# EAGLE schematic dimmer (EAGLE 6.4)
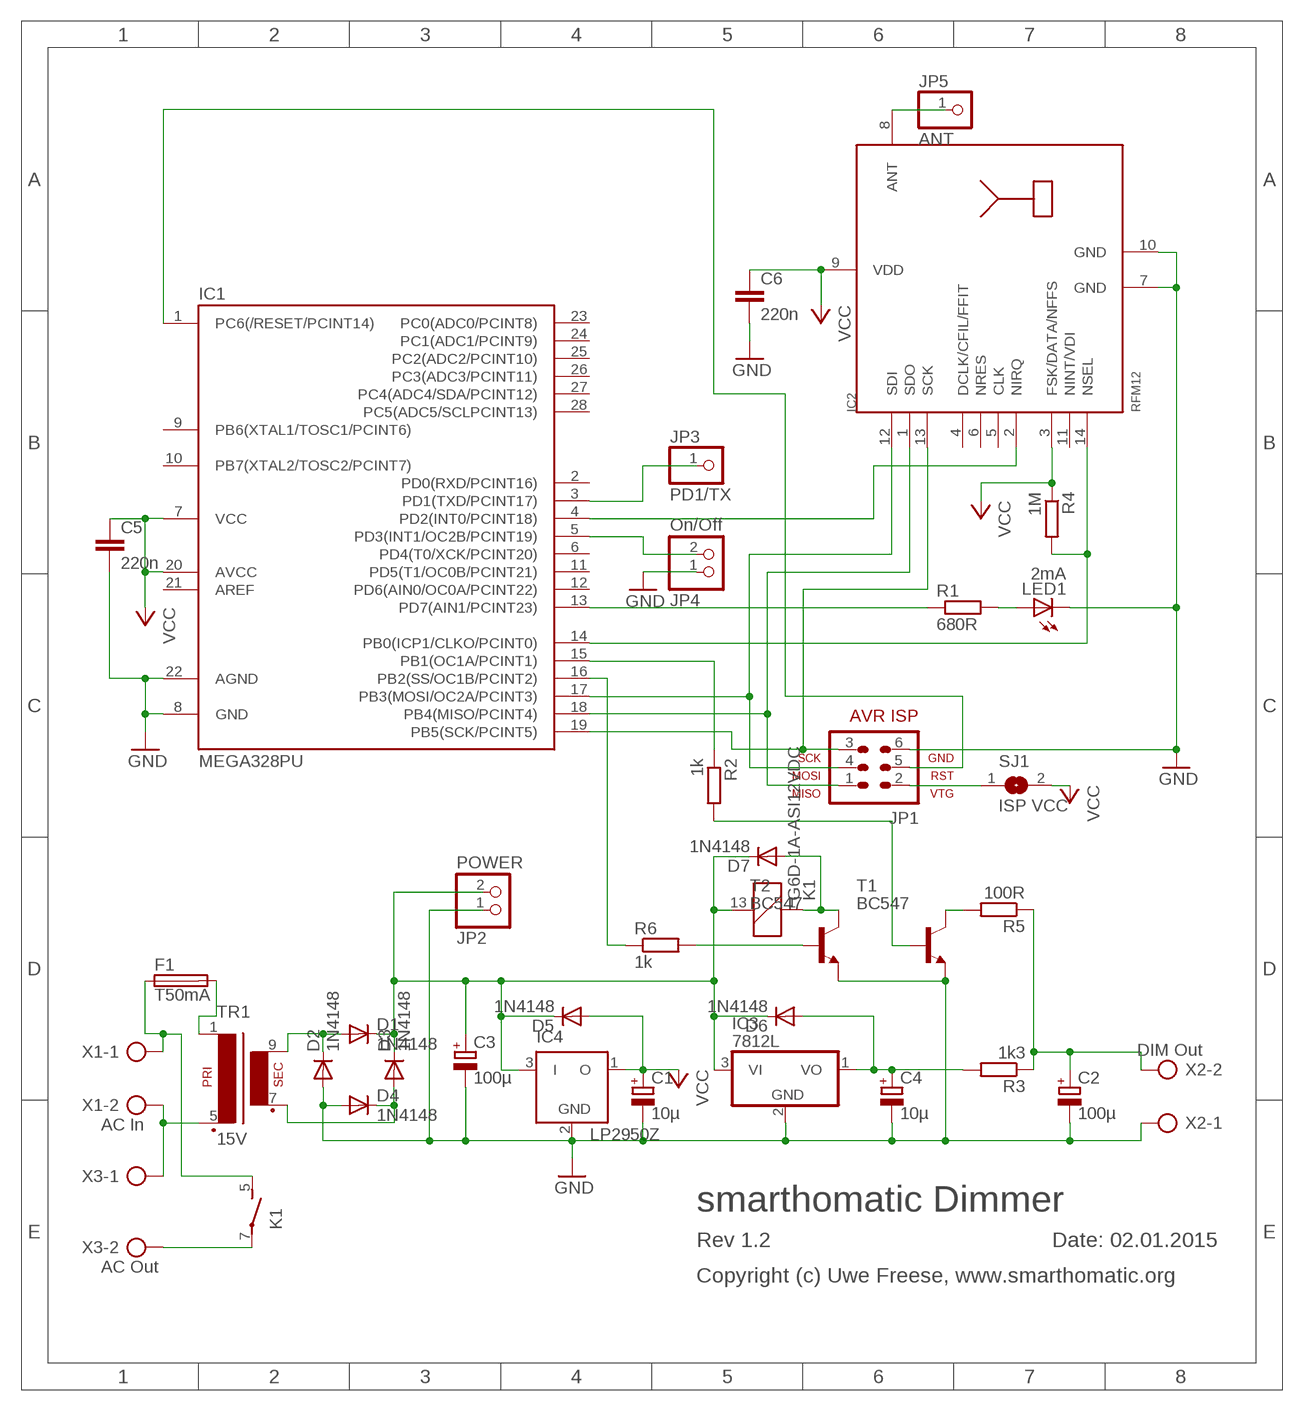
[diagram p0: schematic, sheet 1]

## Parts
C1  10µ  CPOL-EUE1.8-4  [E1,8-4]
C2  100µ  CPOL-EUE1.8-4  [E1,8-4]
C3  100µ  CPOL-EUE1.8-4  [E1,8-4]
C4  10µ  CPOL-EUE1.8-4  [E1,8-4]
C5  220n  C2,5-3  [C2.5-3]
C6  220n  C2,5-3  [C2.5-3]
D1  1N4148  1N4148DO35-7  [DO35-7]
D2  1N4148  1N4148DO35-7  [DO35-7]
D3  1N4148  1N4148DO35-7  [DO35-7]
D4  1N4148  1N4148DO35-7  [DO35-7]
D5  1N4148  1N4148DO35-7  [DO35-7]
D6  1N4148  1N4148DO35-7  [DO35-7]
D7  1N4148  1N4148DO35-7  [DO35-7]
F1  T50mA  SH22,5  [SH22,5]
IC1  MEGA328PU  MEGA48/88/168-PU  [DIL28-3]
IC2  RFM12  [RFM]
IC3  7812L  [TO92]
IC4  LP2950Z  [TO92]
JP1  AVR-ISP-6  [AVR-ISP-6]
JP2  POWER  PINHD-1X2  [1X02]
JP3  PD1/TX  PINHD-1X1  [1X01]
JP4  On/Off  PINHD-1X2  [1X02]
JP5  ANT  PINHD-1X1  [1X01]
K1  G6D-1A-ASI12VDC  [G6D]
LED1  2mA  LED3MM  [LED3MM]
R1  680R  R-EU_0207/7  [0207/7]
R2  1k  R-EU_0207/7  [0207/7]
R3  1k3  R-EU_0207/7  [0207/7]
R4  1M  R-EU_0207/7  [0207/7]
R5  100R  R-EU_0207/7  [0207/7]
R6  1k  R-EU_0207/7  [0207/7]
SJ1  ISP VCC  SJ  [SJ]
T1  BC547  [TO92]
T2  BC547  [TO92]
TR1  15V  EI30-1  [EI30-1]
X1  AC In  AK500/2  [AK500/2]
X2  DIM Out  AK500/2  [AK500/2]
X3  AC Out  AK500/2  [AK500/2]

## Nets
GND: C1.- C2.- C3.- C4.- C5.2 C6.2 D2.A D4.A IC1.8(GND) IC1.22(AGND) IC2.7(GND) IC2.10(GND) IC3.2(GND) IC4.2(GND) JP1.6 JP2.1 JP4.1 LED1.K(C) T1.1(E) T2.1(E) X2.1
N$1: D1.A D2.C TR1.9(S4)
N$2: R5.2 T1.3(C)
N$3: IC1.17(PB3(MOSI/OC2A/PCINT3)) IC2.12(SDI) JP1.4
N$4: IC1.18(PB4(MISO/PCINT4)) IC2.1(SDO) JP1.1
N$5: IC1.19(PB5(SCK/PCINT5)) IC2.13(SCK) JP1.3
N$6: IC1.13(PD7(AIN1/PCINT23)) R1.1
N$7: D3.A D4.C TR1.7(S3)
N$8: IC1.1(PC6(/RESET/PCINT14)) JP1.5
N$9: C3.+ D1.C D3.C D5.C D6.C D7.C IC3.3(VI) IC4.3(I) JP2.2 K1.13
N$10: C4.+ D6.A IC3.1(VO) R3.2
N$11: IC2.8(ANT) JP5.1
N$12: LED1.A R1.2
N$13: IC1.14(PB0(ICP1/CLKO/PCINT0)) IC2.14(NSEL) R4.2
N$14: IC1.15(PB1(OC1A/PCINT1)) R2.1
N$15: IC1.4(PD2(INT0/PCINT18)) IC2.2(NIRQ)
N$16: R2.2 T1.2(B)
N$17: C2.+ R3.1 R5.1 X2.2
N$18: D7.A K1.1 T2.3(C)
N$19: TR1.5(P2) X1.2 X3.1
N$20: K1.7(2:P) X3.2
N$21: JP1.2 SJ1.1
N$22: F1.1 K1.5(2:S) X1.1
N$23: F1.2 TR1.1
N$24: R6.2 T2.2(B)
N$25: IC1.16(PB2(SS/OC1B/PCINT2)) R6.1
N$26: IC1.3(PD1(TXD/PCINT17)) JP3.1
N$27: IC1.5(PD3(INT1/OC2B/PCINT19)) JP4.2
VCC: C1.+ C5.1 C6.1 D5.A IC1.7(VCC) IC1.20(AVCC) IC2.3(FSK/DATA/NFFS) IC2.9(VDD) IC4.1(O) R4.1 SJ1.2
Unconnected: IC1.2(PD0(RXD/PCINT16)) IC1.6(PD4(T0/XCK/PCINT20)) IC1.9(PB6(XTAL1/TOSC1/PCINT6)) IC1.10(PB7(XTAL2/TOSC2/PCINT7)) IC1.11(PD5(T1/OC0B/PCINT21)) IC1.12(PD6(AIN0/OC0A/PCINT22)) IC1.21(AREF) IC1.23(PC0(ADC0/PCINT8)) IC1.24(PC1(ADC1/PCINT9)) IC1.25(PC2(ADC2/PCINT10)) IC1.26(PC3(ADC3/PCINT11)) IC1.27(PC4(ADC4/SDA/PCINT12)) IC1.28(PC5(ADC5/SCLPCINT13)) IC2.4(DCLK/CFIL/FFIT) IC2.5(CLK) IC2.6(NRES) IC2.11(NINT/VDI)

## Notes on the sheet
- smarthomatic Dimmer
- Rev 1.2 | Date: 02.01.2015
- Copyright (c) Uwe Freese, www.smarthomatic.org

## Library data of the parts
C1-C4 = rcl:CPOL-EU: POLARIZED CAPACITOR, European symbol
C5 C6 = capacitor-wima:C: CAPACITOR naming: grid - package width
D1-D7 = diode:1N4148: DIODE high speed (Philips)
F1 = fuse:SH22,5: FUSE HOLDER grid 22,5 mm, OGN0031 8201, Schurter (Buerklin); MF: SCHURTER; MPN: 0031.8201; OC_FARNELL: 1162740; OC_NEWARK: 96F8317
IC1 = avr-5-4.16:MEGA48/88/168-PU
IC2 = hopeRF:RFM12
IC3 = linear:78*: Positive VOLTAGE REGULATOR Source: http://cache.national.com/ds/LM/LM78L05.pdf http://www.fairchildsemi.com/ds/LM/LM7805.pdf
IC4 = linear:LP2950: 100 mA, Low Power Low Dropout Voltage Regulator Source: http://www.onsemi.com/pub/Collateral/LP2950-D.PDF
JP1 = avr-5-4.16:AVR-ISP-6: AVR ISP-6 Serial Programming Header
JP2 JP4 = pinhead:PINHD-1X2: PIN HEADER
JP3 JP5 = pinhead:PINHD-1X1: PIN HEADER
K1 = relay:G6D?*: OMRON Slim, Miniature PCB Relay 17.5 × 6.5 × 12.5 mm with Socked Source: http://ecb.omron.com.sg/pdf/relay/power/G6D.pdf; OC_FARNELL: unknown; OC_NEWARK: unknown
LED1 = led:LED: LED OSRAM: - CHIPLED LG R971, LG N971, LY N971, LG Q971, LY Q971, LO R971, LY R971 LH N974, LH R974 LS Q976, LO Q976, LY Q976 LO Q996 - Hyper CHIPLED LW Q18S LB Q993, LB Q99A, LB R99A - SideLED LS A670, LO A670, LY A670, LG A670, LP A670 LB A673, LV A673, LT A673, LW A673 LH A674 LY A675 LS A676, LA A676, LO A676, LY A676, LW A676 LS A679, LY A679, LG A679 - Hyper Micro SIDELED® LS Y876, LA Y876, LO Y876, LY Y876 LT Y87S - SmartLED LW L88C, LW L88S LB L89C, LB L89S, LG L890 LS L89K, LO L89K, LY L89K LS L896, LA L896, LO L896, LY L896 - TOPLED LS T670, LO T670, LY T670, LG T670, LP T670 LSG T670, LSP T670, LSY T670, LOP T670, LYG T670 LG T671, LOG T671, LSG T671 LB T673, LV T673, LT T673, LW T673 LH T674 LS T676, LA T676, LO T676, LY T676, LB T676, LH T676, LSB T676, LW T676 LB T67C, LV T67C, LT T67C, LS T67K, LO T67K, LY T67K, LW E67C LS E67B, LA E67B, LO E67B, LY E67B, LB E67C, LV E67C, LT E67C LW T67C LS T679, LY T679, LG T679 LS T770, LO T770, LY T770, LG T770, LP T770 LB T773, LV T773, LT T773, LW T773 LH T774 LS E675, LA E675, LY E675, LS T675 LS T776, LA T776, LO T776, LY T776, LB T776 LHGB T686 LT T68C, LB T68C - Hyper Mini TOPLED® LB M676 - Mini TOPLED Santana® LG M470 LS M47K, LO M47K, LY M47K Source: http://www.osram.convergy.de LUXEON: - LUMILED® LXK2-PW12-R00, LXK2-PW12-S00, LXK2-PW14-U00, LXK2-PW14-V00 LXK2-PM12-R00, LXK2-PM12-S00, LXK2-PM14-U00 LXK2-PE12-Q00, LXK2-PE12-R00, LXK2-PE12-S00, LXK2-PE14-T00, LXK2-PE14-U00 LXK2-PB12-K00, LXK2-PB12-L00, LXK2-PB12-M00, LXK2-PB14-N00, LXK2-PB14-P00, LXK2-PB14-Q00 LXK2-PR12-L00, LXK2-PR12-M00, LXK2-PR14-Q00, LXK2-PR14-R00 LXK2-PD12-Q00, LXK2-PD12-R00, LXK2-PD12-S00 LXK2-PH12-R00, LXK2-PH12-S00 LXK2-PL12-P00, LXK2-PL12-Q00, LXK2-PL12-R00 Source: www.luxeon.com KINGBRIGHT: KA-3528ASYC Source: www.kingbright.com
R1-R6 = rcl:R-EU_: RESISTOR, European symbol
SJ1 = jumper:SJ: SMD solder JUMPER
T1 T2 = transistor:BC547: NPN TRANSISTOR
TR1 = trafo:EI30-1: TRANSFORMER 1 primary winding, 1 secondary winding ERA
X1-X3 = con-ptr500:AK500/2: CONNECTOR; OC_FARNELL: unknown; OC_NEWARK: unknown